# EAGLE schematic tgam_breakout (EAGLE 6.4)
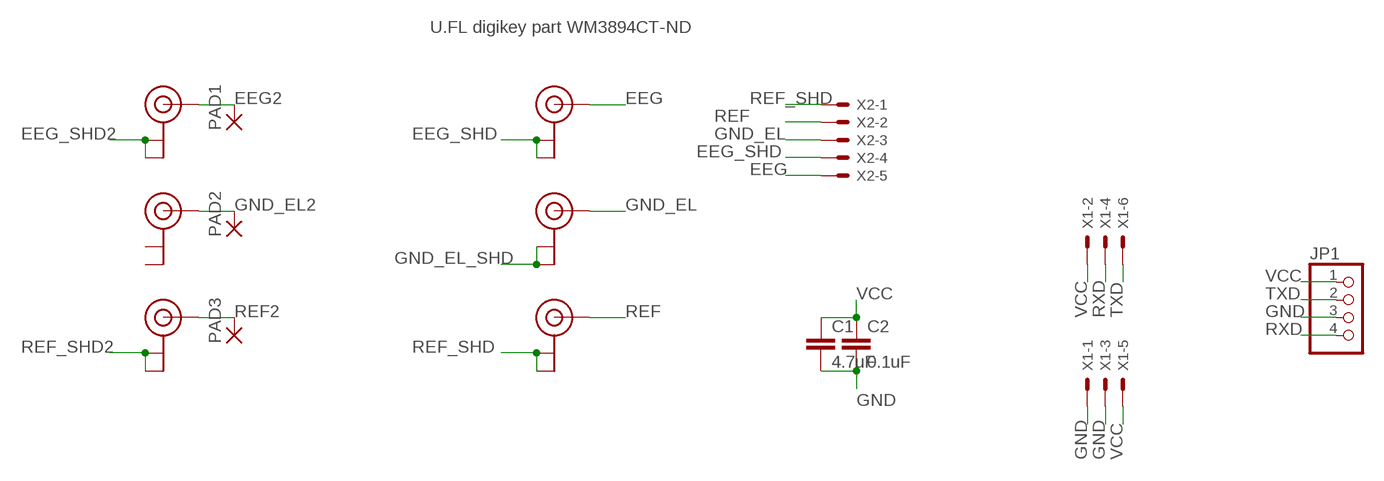
[diagram p0: schematic, sheet 1]

## Parts
C1  4.7uF  C-EUC0805  [C0805]
C2  0.1uF  C-EUC0805  [C0805]
EEG  U.FL  [U.FL]
EEG_EL  U.FL  [U.FL]
GND_EL  U.FL  [U.FL]
GND_ELEL  U.FL  [U.FL]
JP1  PINHD-1X4  [1X04]
PAD1  SMD5  [SMD2,54-5,08]
PAD2  SMD5  [SMD2,54-5,08]
PAD3  SMD5  [SMD2,54-5,08]
REF  U.FL  [U.FL]
REF_EL  U.FL  [U.FL]
X1  332-06  [332-06]
X2  332-10  [2MM5SIL]

## Nets
EEG: EEG.P$3(SIGNAL) X2.9
EEG2: EEG_EL.P$3(SIGNAL) PAD1.1(P)
EEG_SHD: EEG.P$1(GND) EEG.P$2(GND) X2.7
EEG_SHD2: EEG_EL.P$1(GND) EEG_EL.P$2(GND)
GND: C1.2 C2.2 JP1.3 X1.1 X1.3
GND_EL: GND_EL.P$3(SIGNAL) X2.5
GND_EL2: GND_ELEL.P$3(SIGNAL) PAD2.1(P)
GND_EL_SHD: GND_EL.P$1(GND) GND_EL.P$2(GND)
REF: REF.P$3(SIGNAL) X2.3
REF2: PAD3.1(P) REF_EL.P$3(SIGNAL)
REF_SHD: REF.P$1(GND) REF.P$2(GND) X2.1
REF_SHD2: REF_EL.P$1(GND) REF_EL.P$2(GND)
RXD: JP1.4 X1.4
TXD: JP1.2 X1.6
VCC: C1.1 C2.1 JP1.1 X1.2 X1.5
Unconnected: GND_ELEL.P$1(GND) GND_ELEL.P$2(GND)

## Notes on the sheet
- U.FL digikey part WM3894CT-ND

## Library data of the parts
C1 C2 = rcl:C-EU: CAPACITOR, European symbol
EEG EEG_EL GND_EL GND_ELEL REF REF_EL = SparkFun-Connectors:U.FL: SMD antenna connector- WRL-09144
JP1 = pinhead:PINHD-1X4: PIN HEADER
PAD1-PAD3 = wirepad:SMD5: SMD PAD
X1 = con-garry:332-06: 6 Pin - 2mm Dual Row Source: www.mpe-connector.de / garry_shortform_2012.pdf
X2 = 2mm:332-10: 5 Pin - 2mm Single Row Source: www.mpe-connector.de / garry_shortform_2012.pdf